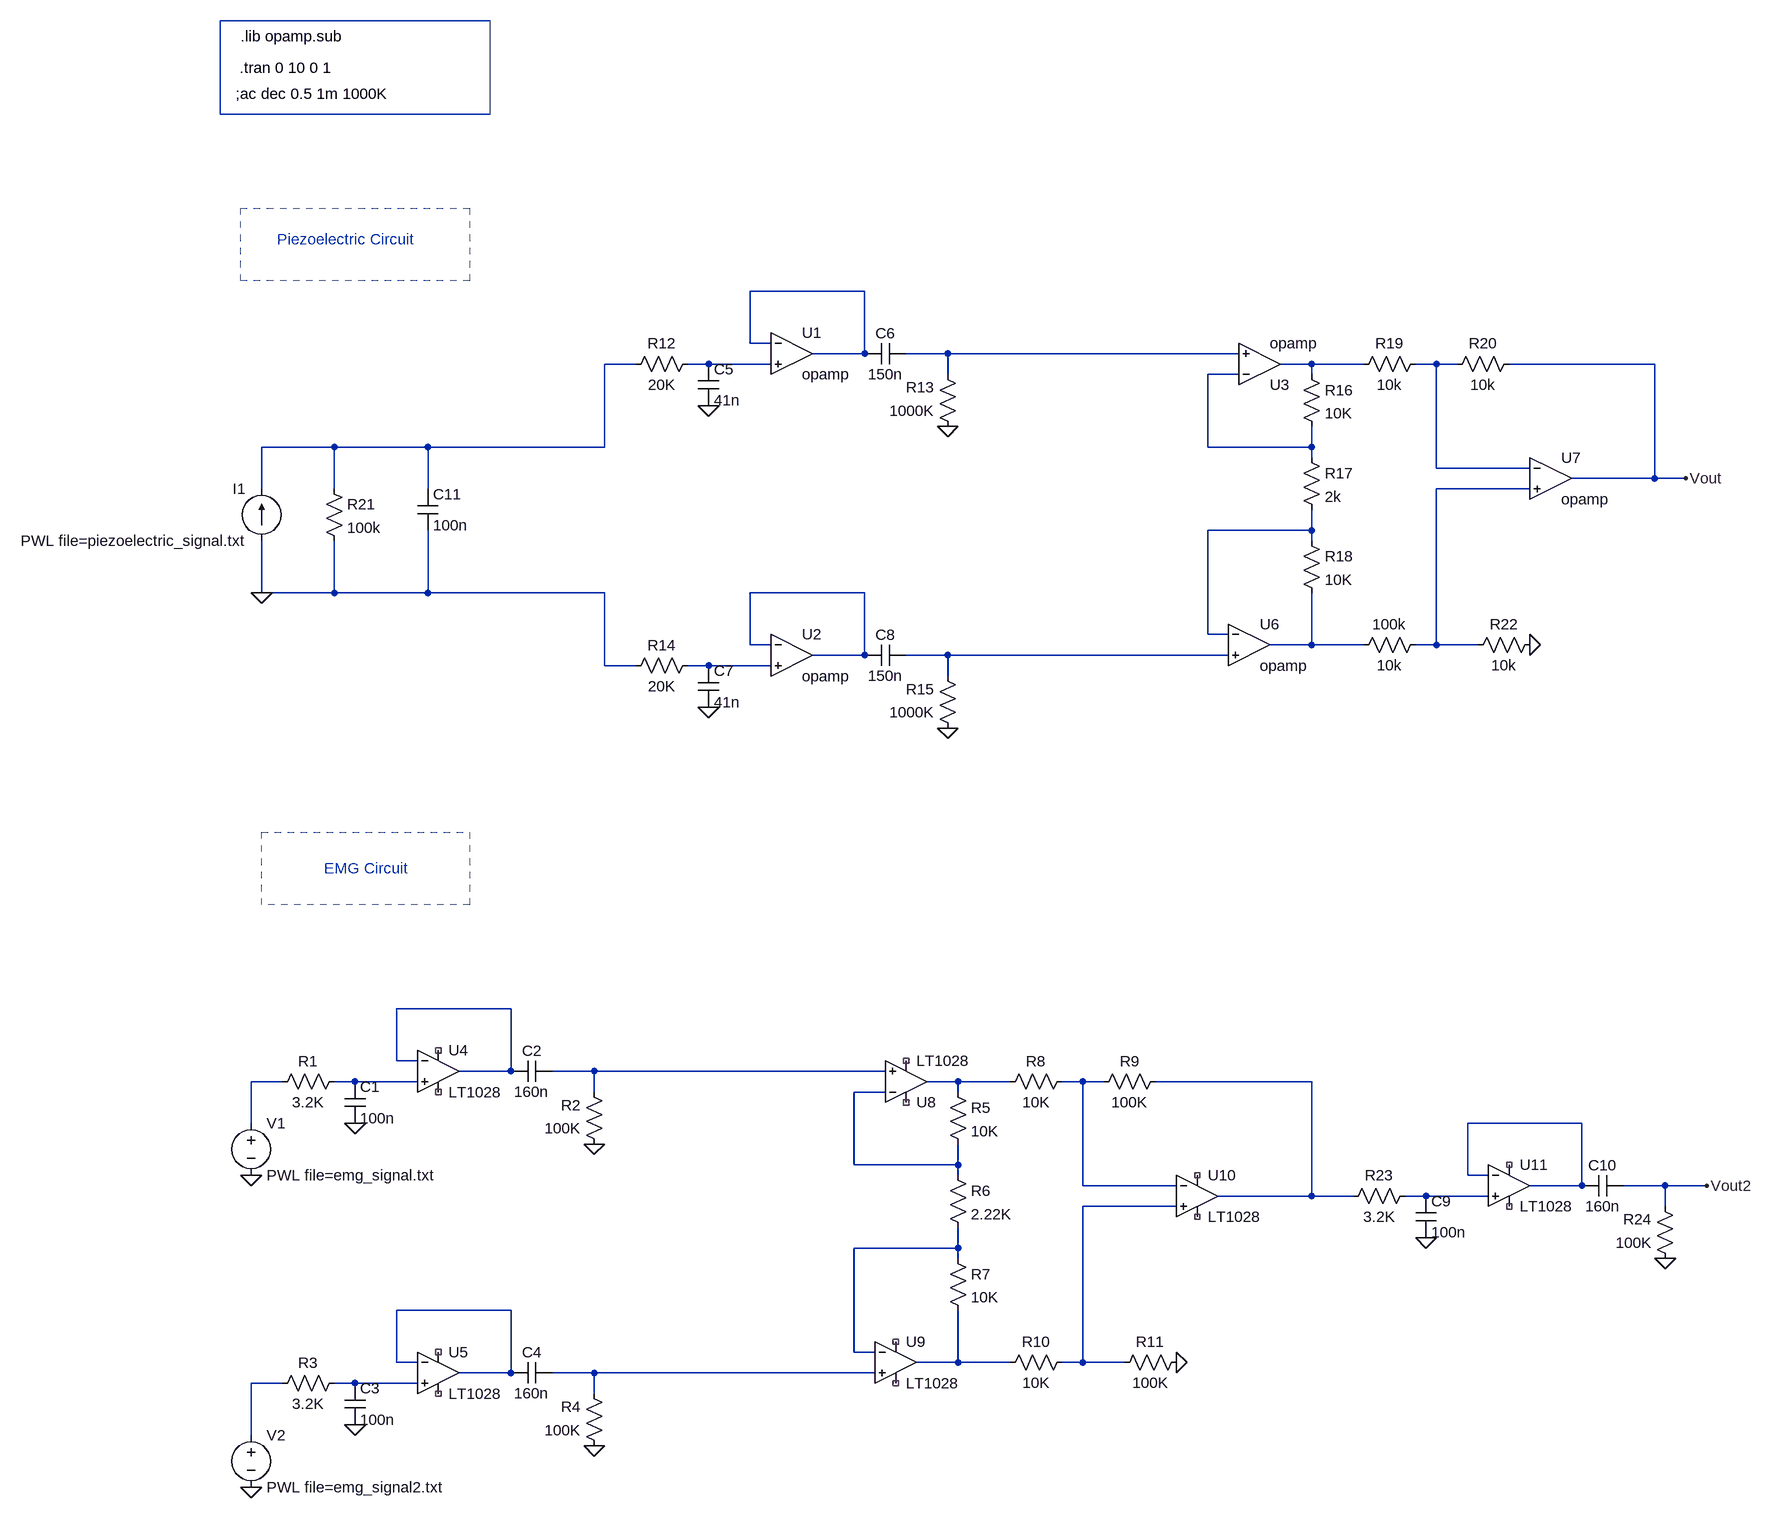
[diagram p0: schematic test_circuit.asc]
test_circuit.asc, the LTspice schematic file:
Version 4
SHEET 1 1972 2388
WIRE -256 -256 -432 -256
WIRE -432 -176 -432 -256
WIRE -400 -176 -432 -176
WIRE -256 -160 -256 -256
WIRE -256 -160 -336 -160
WIRE -128 -160 -192 -160
WIRE 320 -160 -128 -160
WIRE -608 -144 -656 -144
WIRE -496 -144 -528 -144
WIRE -400 -144 -496 -144
WIRE 432 -144 384 -144
WIRE 512 -144 432 -144
WIRE 624 -144 592 -144
WIRE 656 -144 624 -144
WIRE 960 -144 736 -144
WIRE -128 -128 -128 -160
WIRE 320 -128 272 -128
WIRE 432 -128 432 -144
WIRE -1072 -16 -1184 -16
WIRE -928 -16 -1072 -16
WIRE -656 -16 -656 -144
WIRE -656 -16 -928 -16
WIRE 272 -16 272 -128
WIRE 432 -16 432 -48
WIRE 432 -16 272 -16
WIRE 432 0 432 -16
WIRE 624 16 624 -144
WIRE 768 16 624 16
WIRE 960 32 960 -144
WIRE 960 32 832 32
WIRE 1008 32 960 32
WIRE -1184 48 -1184 -16
WIRE -1072 48 -1072 -16
WIRE -928 48 -928 -16
WIRE 768 48 624 48
WIRE 432 112 432 80
WIRE 432 112 272 112
WIRE 432 128 432 112
WIRE -1184 208 -1184 128
WIRE -1072 208 -1072 128
WIRE -1072 208 -1184 208
WIRE -928 208 -928 112
WIRE -928 208 -1072 208
WIRE -656 208 -928 208
WIRE -256 208 -432 208
WIRE 272 272 272 112
WIRE 304 272 272 272
WIRE -432 288 -432 208
WIRE -400 288 -432 288
WIRE 432 288 432 208
WIRE 432 288 368 288
WIRE 512 288 432 288
WIRE 624 288 624 48
WIRE 624 288 592 288
WIRE 688 288 624 288
WIRE -256 304 -256 208
WIRE -256 304 -336 304
WIRE -128 304 -192 304
WIRE 304 304 -128 304
WIRE -656 320 -656 208
WIRE -608 320 -656 320
WIRE -496 320 -528 320
WIRE -400 320 -496 320
WIRE -128 336 -128 304
WIRE -800 848 -976 848
WIRE -976 928 -976 848
WIRE -944 928 -976 928
WIRE -800 944 -800 848
WIRE -800 944 -880 944
WIRE -672 944 -736 944
WIRE -224 944 -672 944
WIRE -1152 960 -1200 960
WIRE -1040 960 -1072 960
WIRE -944 960 -1040 960
WIRE -112 960 -160 960
WIRE -32 960 -112 960
WIRE 80 960 48 960
WIRE 112 960 80 960
WIRE 432 960 192 960
WIRE -672 976 -672 944
WIRE -224 976 -272 976
WIRE -112 976 -112 960
WIRE -1200 1024 -1200 960
WIRE 848 1024 672 1024
WIRE -272 1088 -272 976
WIRE -112 1088 -112 1056
WIRE -112 1088 -272 1088
WIRE -112 1104 -112 1088
WIRE 672 1104 672 1024
WIRE 704 1104 672 1104
WIRE 80 1120 80 960
WIRE 224 1120 80 1120
WIRE 848 1120 848 1024
WIRE 848 1120 768 1120
WIRE 976 1120 912 1120
WIRE 1040 1120 976 1120
WIRE 432 1136 432 960
WIRE 432 1136 288 1136
WIRE 496 1136 432 1136
WIRE 608 1136 576 1136
WIRE 704 1136 608 1136
WIRE 224 1152 80 1152
WIRE 976 1152 976 1120
WIRE -112 1216 -112 1184
WIRE -112 1216 -272 1216
WIRE -112 1232 -112 1216
WIRE -800 1312 -976 1312
WIRE -272 1376 -272 1216
WIRE -240 1376 -272 1376
WIRE -976 1392 -976 1312
WIRE -944 1392 -976 1392
WIRE -112 1392 -112 1312
WIRE -112 1392 -176 1392
WIRE -32 1392 -112 1392
WIRE 80 1392 80 1152
WIRE 80 1392 48 1392
WIRE 144 1392 80 1392
WIRE -800 1408 -800 1312
WIRE -800 1408 -880 1408
WIRE -672 1408 -736 1408
WIRE -240 1408 -672 1408
WIRE -1152 1424 -1200 1424
WIRE -1040 1424 -1072 1424
WIRE -944 1424 -1040 1424
WIRE -672 1440 -672 1408
WIRE -1200 1504 -1200 1424
FLAG -1040 1024 0
FLAG -672 1056 0
FLAG -1040 1488 0
FLAG -672 1520 0
FLAG -1200 1104 0
FLAG -1200 1584 0
FLAG 608 1200 0
FLAG 976 1232 0
FLAG -496 -80 0
FLAG -128 -48 0
FLAG -496 384 0
FLAG -128 416 0
FLAG 1008 32 Vout
FLAG 1040 1120 Vout2
FLAG 768 288 0
FLAG 224 1392 0
FLAG -1184 208 0
SYMBOL voltage -1200 1008 R0
WINDOW 123 24 124 Left 2
WINDOW 39 0 0 Left 0
SYMATTR InstName V1
SYMATTR Value PWL file=emg_signal.txt
SYMBOL cap -1056 960 R0
SYMATTR InstName C1
SYMATTR Value 100n
SYMBOL res -1056 944 R90
WINDOW 0 0 56 VBottom 2
WINDOW 3 32 56 VTop 2
SYMATTR InstName R1
SYMATTR Value 3.2K
SYMBOL res -656 1072 R180
WINDOW 0 36 76 Left 2
WINDOW 3 36 40 Left 2
SYMATTR InstName R2
SYMATTR Value 100K
SYMBOL cap -736 928 R90
WINDOW 0 0 32 VBottom 2
WINDOW 3 32 32 VTop 2
SYMATTR InstName C2
SYMATTR Value 160n
SYMBOL voltage -1200 1488 R0
WINDOW 123 24 124 Left 2
WINDOW 39 0 0 Left 0
SYMATTR InstName V2
SYMATTR Value PWL file=emg_signal2.txt
SYMBOL cap -1056 1424 R0
SYMATTR InstName C3
SYMATTR Value 100n
SYMBOL res -1056 1408 R90
WINDOW 0 0 56 VBottom 2
WINDOW 3 32 56 VTop 2
SYMATTR InstName R3
SYMATTR Value 3.2K
SYMBOL res -656 1536 R180
WINDOW 0 36 76 Left 2
WINDOW 3 36 40 Left 2
SYMATTR InstName R4
SYMATTR Value 100K
SYMBOL cap -736 1392 R90
WINDOW 0 0 32 VBottom 2
WINDOW 3 32 32 VTop 2
SYMATTR InstName C4
SYMATTR Value 160n
SYMBOL res -128 960 R0
SYMATTR InstName R5
SYMATTR Value 10K
SYMBOL res -128 1088 R0
SYMATTR InstName R6
SYMATTR Value 2.22K
SYMBOL res -128 1216 R0
SYMATTR InstName R7
SYMATTR Value 10K
SYMBOL res 64 944 R90
WINDOW 0 0 56 VBottom 2
WINDOW 3 32 56 VTop 2
SYMATTR InstName R8
SYMATTR Value 10K
SYMBOL res 208 944 R90
WINDOW 0 0 56 VBottom 2
WINDOW 3 32 56 VTop 2
SYMATTR InstName R9
SYMATTR Value 100K
SYMBOL res 64 1376 R90
WINDOW 0 0 56 VBottom 2
WINDOW 3 32 56 VTop 2
SYMATTR InstName R10
SYMATTR Value 10K
SYMBOL res 240 1376 R90
WINDOW 0 0 56 VBottom 2
WINDOW 3 32 56 VTop 2
SYMATTR InstName R11
SYMATTR Value 100K
SYMBOL cap 592 1136 R0
SYMATTR InstName C9
SYMATTR Value 100n
SYMBOL res 592 1120 R90
WINDOW 0 0 56 VBottom 2
WINDOW 3 32 56 VTop 2
SYMATTR InstName R23
SYMATTR Value 3.2K
SYMBOL res 992 1248 R180
WINDOW 0 36 76 Left 2
WINDOW 3 36 40 Left 2
SYMATTR InstName R24
SYMATTR Value 100K
SYMBOL cap 912 1104 R90
WINDOW 0 0 32 VBottom 2
WINDOW 3 32 32 VTop 2
SYMATTR InstName C10
SYMATTR Value 160n
SYMBOL cap -512 -144 R0
SYMATTR InstName C5
SYMATTR Value 41n
SYMBOL res -512 -160 R90
WINDOW 0 0 56 VBottom 2
WINDOW 3 32 56 VTop 2
SYMATTR InstName R12
SYMATTR Value 20K
SYMBOL res -112 -32 R180
WINDOW 0 36 76 Left 2
WINDOW 3 36 40 Left 2
SYMATTR InstName R13
SYMATTR Value 1000K
SYMBOL cap -192 -176 R90
WINDOW 0 0 32 VBottom 2
WINDOW 3 32 32 VTop 2
SYMATTR InstName C6
SYMATTR Value 150n
SYMBOL cap -512 320 R0
SYMATTR InstName C7
SYMATTR Value 41n
SYMBOL res -512 304 R90
WINDOW 0 0 56 VBottom 2
WINDOW 3 32 56 VTop 2
SYMATTR InstName R14
SYMATTR Value 20K
SYMBOL res -112 432 R180
WINDOW 0 36 76 Left 2
WINDOW 3 36 40 Left 2
SYMATTR InstName R15
SYMATTR Value 1000K
SYMBOL cap -192 288 R90
WINDOW 0 0 32 VBottom 2
WINDOW 3 32 32 VTop 2
SYMATTR InstName C8
SYMATTR Value 150n
SYMBOL res 416 -144 R0
SYMATTR InstName R16
SYMATTR Value 10K
SYMBOL res 416 -16 R0
SYMATTR InstName R17
SYMATTR Value 2k
SYMBOL res 416 112 R0
SYMATTR InstName R18
SYMATTR Value 10K
SYMBOL res 608 -160 R90
WINDOW 0 0 56 VBottom 2
WINDOW 3 32 56 VTop 2
SYMATTR InstName R19
SYMATTR Value 10k
SYMBOL res 752 -160 R90
WINDOW 0 0 56 VBottom 2
WINDOW 3 32 56 VTop 2
SYMATTR InstName R20
SYMATTR Value 10k
SYMBOL res 608 272 R90
WINDOW 0 0 56 VBottom 2
WINDOW 3 32 56 VTop 2
SYMATTR InstName 100k
SYMATTR Value 10k
SYMBOL res 784 272 R90
WINDOW 0 0 56 VBottom 2
WINDOW 3 32 56 VTop 2
SYMATTR InstName R22
SYMATTR Value 10k
SYMBOL current -1184 128 R180
WINDOW 0 24 80 Left 2
WINDOW 3 24 0 Left 2
WINDOW 123 24 -28 Left 2
WINDOW 39 0 0 Left 0
SYMATTR InstName I1
SYMATTR Value PWL file=piezoelectric_signal.txt
SYMBOL res -1088 32 R0
SYMATTR InstName R21
SYMATTR Value 100k
SYMBOL cap -944 48 R0
SYMATTR InstName C11
SYMATTR Value 100n
SYMBOL OpAmps\\opamp -368 -224 R0
SYMATTR InstName U1
SYMBOL OpAmps\\opamp -368 240 R0
SYMATTR InstName U2
SYMBOL OpAmps\\opamp 352 -80 M180
SYMATTR InstName U3
SYMBOL OpAmps\\opamp 336 224 R0
SYMATTR InstName U6
SYMBOL OpAmps\\opamp 800 -32 R0
SYMATTR InstName U7
SYMBOL OpAmps\\LT1028 -912 880 R0
SYMATTR InstName U4
SYMBOL OpAmps\\LT1028 -912 1344 R0
SYMATTR InstName U5
SYMBOL OpAmps\\LT1028 -192 1024 M180
SYMATTR InstName U8
SYMBOL OpAmps\\LT1028 -208 1328 R0
SYMATTR InstName U9
SYMBOL OpAmps\\LT1028 256 1072 R0
SYMATTR InstName U10
SYMBOL OpAmps\\LT1028 736 1056 R0
SYMATTR InstName U11
TEXT -1216 -648 Left 2 !.lib opamp.sub
TEXT -1218 -600 Left 2 !.tran 0 10 0 1
TEXT -1224 -560 Left 2 !;ac dec 0.5 1m 1000K
TEXT -1160 -336 Left 2 ;Piezoelectric Circuit
TEXT -1088 632 Left 2 ;EMG Circuit
RECTANGLE Normal -832 -528 -1248 -672
RECTANGLE Normal -864 -272 -1216 -384 2
RECTANGLE Normal -864 688 -1184 576 2

The netlist it stands for:
* test_circuit.asc
V1 N016 0 PWL file=emg_signal.txt
C1 N017 0 100n
R1 N017 N016 3.2K
R2 0 N015 100K
C2 N015 N014 160n
V2 N029 0 PWL file=emg_signal2.txt
C3 N030 0 100n
R3 N030 N029 3.2K
R4 0 N028 100K
C4 N028 N026 160n
R5 N018 N021 10K
R6 N021 N025 2.22K
R7 N025 N027 10K
R8 N019 N018 10K
R9 N020 N019 100K
R10 N024 N027 10K
R11 0 N024 100K
C9 N023 0 100n
R23 N023 N020 3.2K
R24 0 Vout2 100K
C10 Vout2 N022 160n
C5 N004 0 41n
R12 N004 N003 20K
R13 0 N002 1000K
C6 N002 N001 150n
C7 N013 0 41n
R14 N013 0 20K
R15 0 N012 1000K
C8 N012 N010 150n
R16 N005 N007 10K
R17 N007 N009 2k
R18 N009 N011 10K
R19 N006 N005 10k
R20 Vout N006 10k
R§100k N008 N011 10k
R22 0 N008 10k
I1 0 N003 PWL file=piezoelectric_signal.txt
R21 N003 0 100k
C11 N003 0 100n
XU1 N001 N004 N001 opamp Aol=100K GBW=10Meg  ; pins invin noninvin out
XU2 N010 N013 N010 opamp Aol=100K GBW=10Meg  ; pins invin noninvin out
XU3 N007 N002 N005 opamp Aol=100K GBW=10Meg  ; pins invin noninvin out
XU6 N009 N012 N011 opamp Aol=100K GBW=10Meg  ; pins invin noninvin out
XU7 N006 N008 Vout opamp Aol=100K GBW=10Meg  ; pins invin noninvin out
XU4 N017 N014 NC_01 NC_02 N014 LT1028  ; pins In+ In- V+ V- OUT
XU5 N030 N026 NC_03 NC_04 N026 LT1028  ; pins In+ In- V+ V- OUT
XU8 N015 N021 NC_05 NC_06 N018 LT1028  ; pins In+ In- V+ V- OUT
XU9 N028 N025 NC_07 NC_08 N027 LT1028  ; pins In+ In- V+ V- OUT
XU10 N024 N019 NC_09 NC_10 N020 LT1028  ; pins In+ In- V+ V- OUT
XU11 N023 N022 NC_11 NC_12 N022 LT1028  ; pins In+ In- V+ V- OUT
.lib opamp.sub
.tran 0 10 0 1
;ac dec 0.5 1m 1000K
* Piezoelectric Circuit
* EMG Circuit
.lib LTC.lib
.backanno
.end